# EasyEDA schematic SCH_Flight-Computer-V5_2024-08-07.json
TITLE: Flight Computer; REV: 1.0; Date: 2024-08-05; Sheet: 1/1; Drawn By: usedgenes; Company: Company
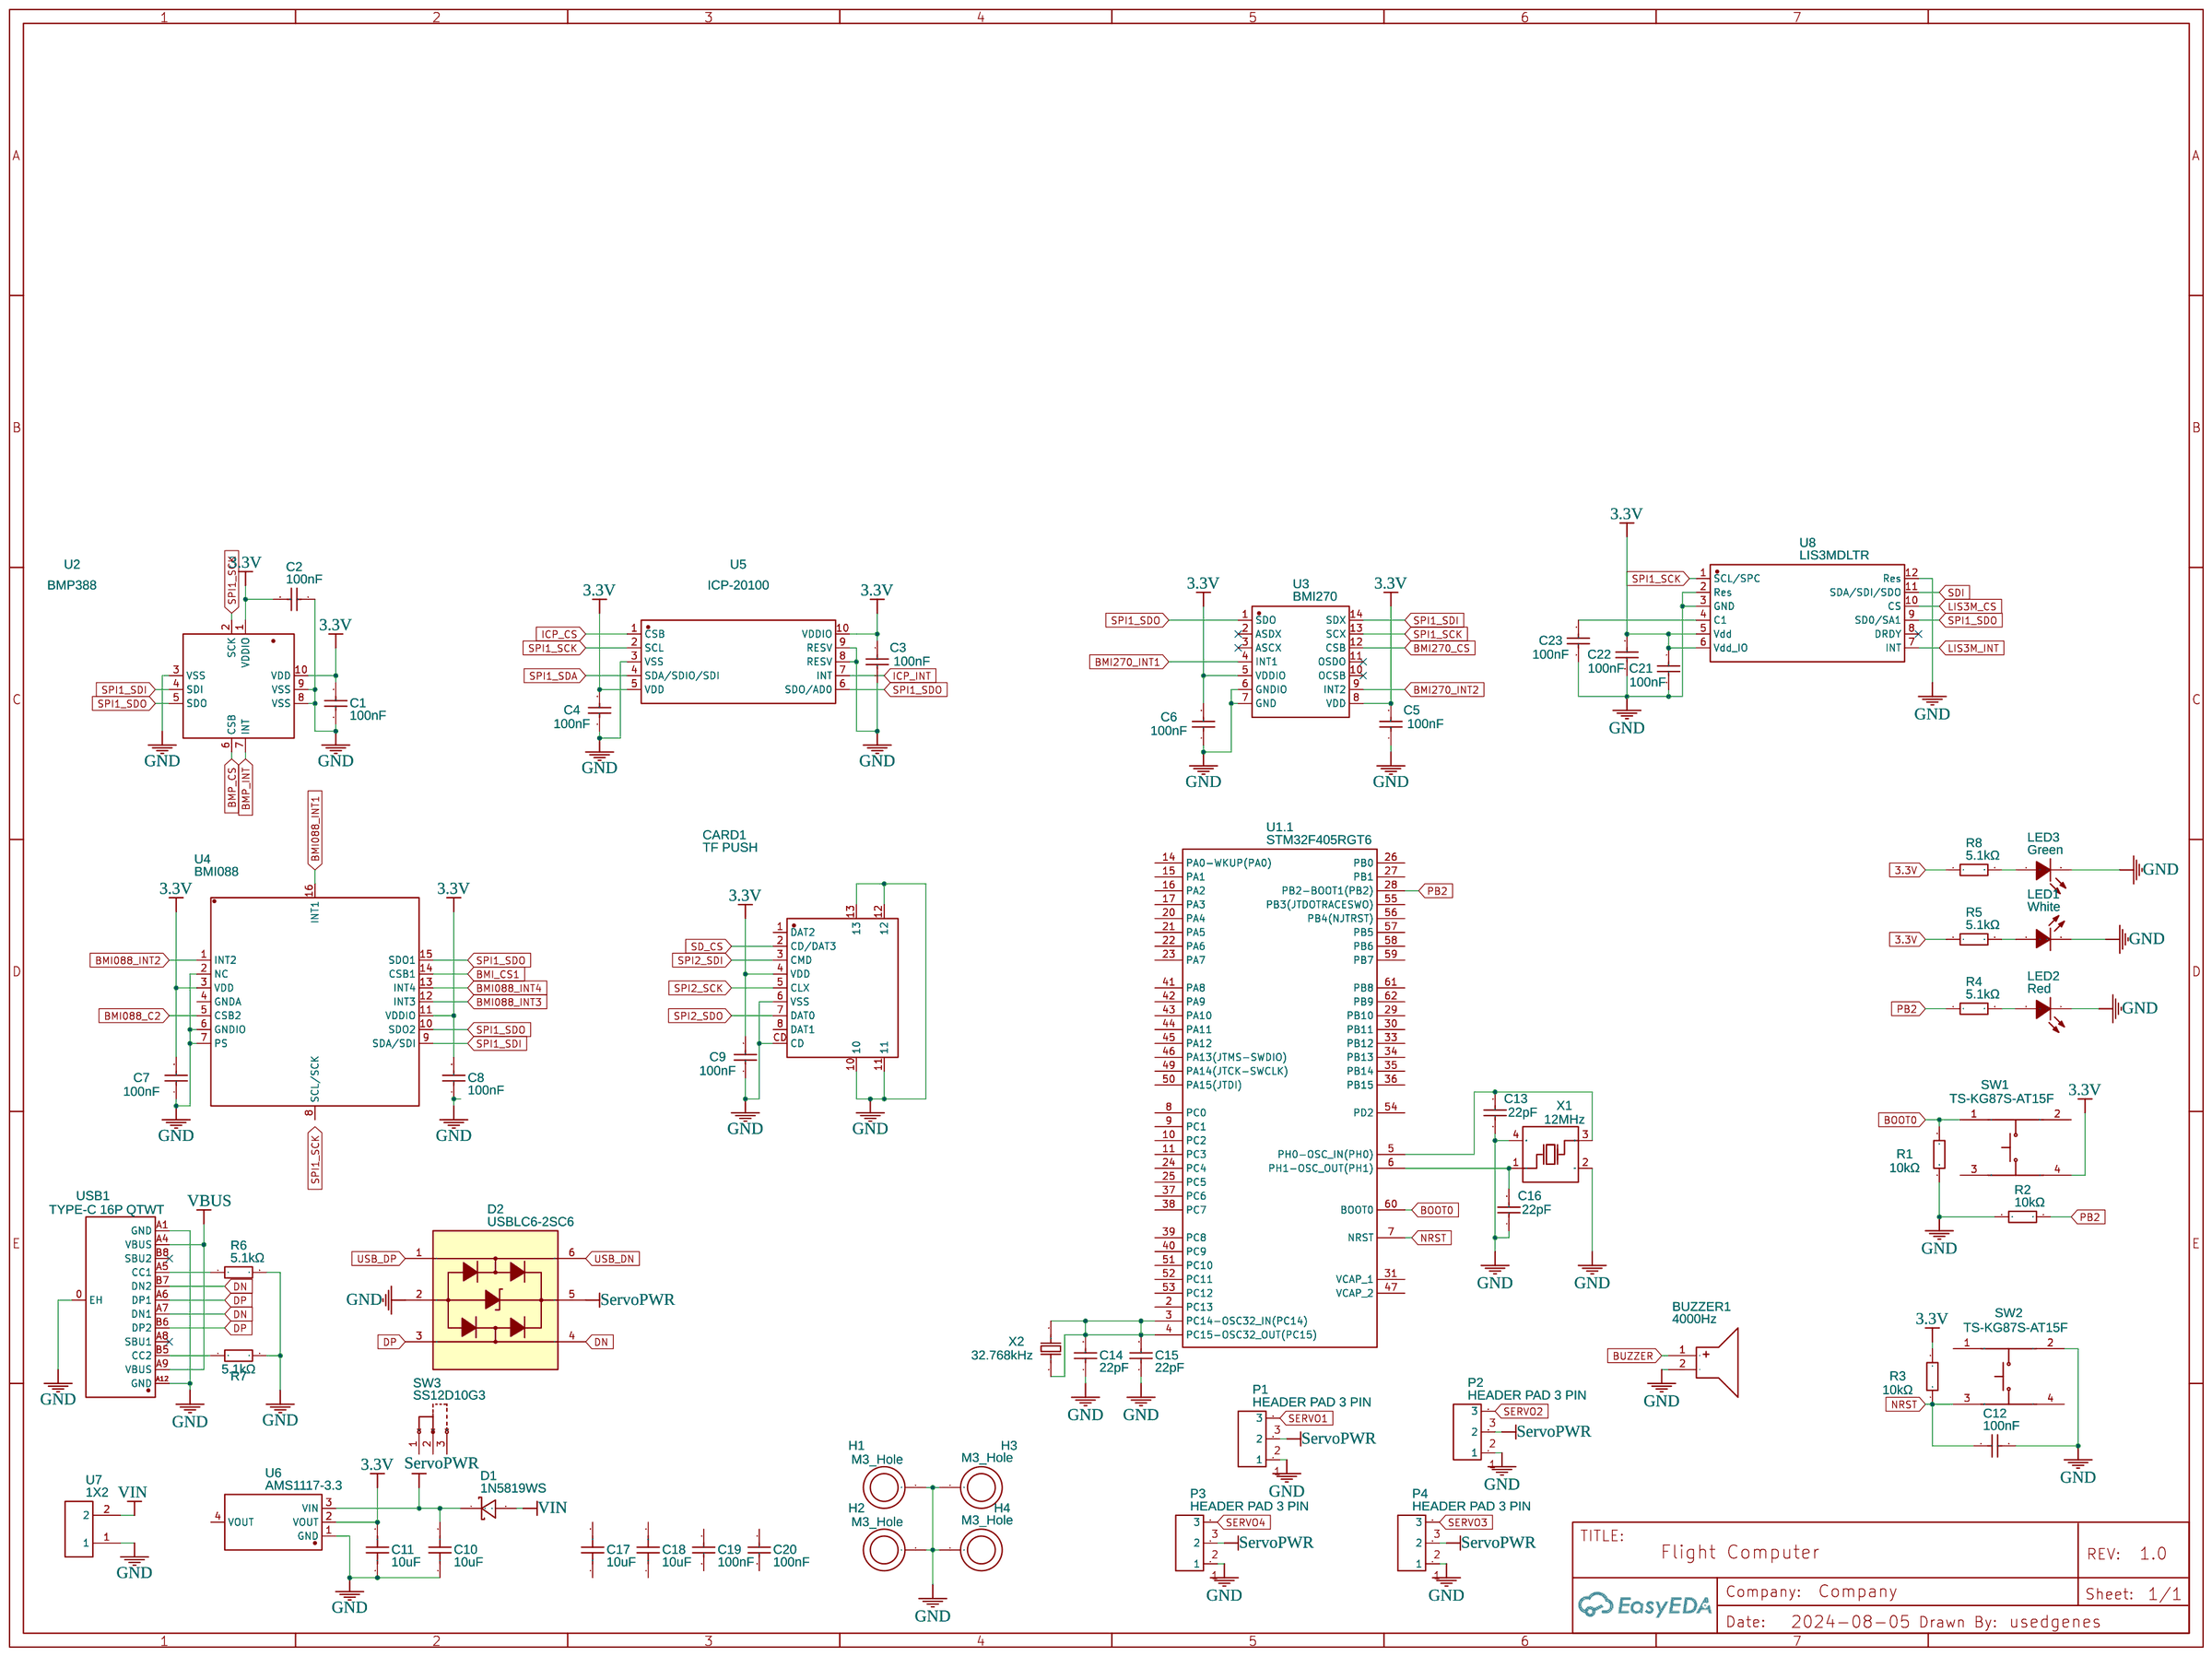
[diagram p0: schematic sheet]

## Parts
BUZZER1  4000Hz  [BUZ-TH_BD14.0-P7.60-D1.0-L]
C1  100nF  [C0402]
C2  100nF  [C0402]
C3  100nF  [C0402]
C4  100nF  [C0402]
C5  100nF  [C0402]
C6  100nF  [C0402]
C7  100nF  [C0402]
C8  100nF  [C0402]
C9  100nF  [C0402]
C10  10uF  [C0603]
C11  10uF  [C0603]
C12  100nF  [C0402]
C13  22pF  [C0402]
C14  22pF  [C0402]
C15  22pF  [C0402]
C16  22pF  [C0402]
C17  10uF  [C0603]
C18  10uF  [C0603]
C19  100nF  [C0402]
C20  100nF  [C0402]
C21  100nF  [C0402]
C22  100nF  [C0402]
C23  100nF  [C0402]
CARD1  TF PUSH  [TF-SMD_TF-PUSH]
D1  1N5819WS  [SOD-323_L1.8-W1.3-LS2.5-RD]
D2  USBLC6-2SC6  [SOT-23-6_L2.9-W1.6-P0.95-LS2.8-BL]
H1  M3_Hole  [HOLEHOLE]
H2  M3_Hole  [HOLEHOLE]
H3  M3_Hole  [HOLEHOLE]
H4  M3_Hole  [HOLEHOLE]
LED1  White  [LED0603-R-RD_WHITE]
LED2  Red  [LED0603-RD]
LED3  Green  [LED0805-R-RD]
P1  HEADER PAD 3 PIN  [CONNECTOR_PINHEADER_2.54MM:PINHEADER_1X3]
P2  HEADER PAD 3 PIN  [CONNECTOR_PINHEADER_2.54MM:PINHEADER_1X3]
P3  HEADER PAD 3 PIN  [CONNECTOR_PINHEADER_2.54MM:PINHEADER_1X3]
P4  HEADER PAD 3 PIN  [CONNECTOR_PINHEADER_2.54MM:PINHEADER_1X3]
R1  10kΩ  [R0603]
R2  10kΩ  [R0603]
R3  10kΩ  [R0603]
R4  5.1kΩ  [R0402]
R5  5.1kΩ  [R0402]
R6  5.1kΩ  [R0603]
R7  5.1kΩ  [R0603]
R8  5.1kΩ  [R0402]
SW1  TS-KG87S-AT15F  [SW-SMD_4P-L5.2-W5.2-P3.70-LS6.4]
SW2  TS-KG87S-AT15F  [SW-SMD_4P-L5.2-W5.2-P3.70-LS6.4]
SW3  SS12D10G3  [SW-TH_3P-P4.8-L12.7-W6.7_SS12D10G3]
U1  STM32F405RGT6  [LQFP-64_L10.0-W10.0-P0.50-LS12.0-BL]  (section 1)
U2  BMP388  [SENSORM-SMD_BMP388]
U3  BMI270  [LGA-14_L3.0-W2.5-P0.50-BR]
U4  BMI088  [LGA-16_L4.5-W3.0-P0.50-BL]
U5  ICP-20100  [LGA-10_L2.0-W2.0-P0.50-TL_ICP-20100]
U6  AMS1117-3.3  [SOT-223-3_L6.5-W3.4-P2.30-LS7.0-BR]
U7  1X2  [PIN HEADER CONNECTOR 1X2 PINS_PITCH 2.54MM]
U8  LIS3MDLTR  [LGA-12_L2.0-W2.0-P0.50-BL]
USB1  TYPE-C 16P QTWT  [USB-TYPE-C-SMD_TYPE-C-16P-QTWT]
X1  12MHz  [OSC-SMD_4P-L3.2-W2.5-BL]
X2  32.768kHz  [OSC-SMD_L3.2-W1.5]

## Library data of the parts
BUZZER1 = SKY-1475-0540-45P7.6: Contributor: LCSC; Supplier: LCSC; Supplier Part: C511707; Manufacturer: S&S(海旭); JLCPCB Part Class: Extended Part
C1-C9 C12 C19-C23 = CL05B104KO5NNNC: Supplier: LCSC; Manufacturer: SAMSUNG(三星); Supplier Part: C1525; JLCPCB Part Class: Basic Part
C10 C11 C17 C18 = CL10A106KP8NNNC: Supplier: LCSC; Manufacturer: SAMSUNG(三星); Supplier Part: C19702; JLCPCB Part Class: Basic Part
C13-C16 = 0402CG220J500NT: Supplier: LCSC; Manufacturer: FH(风华); Supplier Part: C1555; JLCPCB Part Class: Basic Part
CARD1 = TF PUSH: Contributor: LCSC; Supplier: LCSC; Supplier Part: C393941; Manufacturer: SHOU HAN(首韩); JLCPCB Part Class: Extended Part
D1 = 1N5819WS: Contributor: LCSC; Supplier: LCSC; Supplier Part: C191023; Manufacturer: Hottech(合科泰); JLCPCB Part Class: Basic Part
D2 = USBLC6-2SC6: Supplier: LCSC; Manufacturer: ST(意法半导体); Supplier Part: C7519; JLCPCB Part Class: Extended Part
H1-H4 = 3MM_HOLE_STICHING_VIAS_4MM_OUTER COPY: Contributor: Cillié Malan
LED1 = 0603White light_C2290: Supplier: LCSC; Manufacturer: KENTO; Manufacturer Part: KT-0603白灯; Supplier Part: C2290; JLCPCB Part Class: Basic Part
LED2 = KT-0603R: Supplier: LCSC; Manufacturer: KENTO; Supplier Part: C2286; JLCPCB Part Class: Basic Part
LED3 = 0805G (Green): Supplier: LCSC; Manufacturer: KENTO; Manufacturer Part: KT-0805G; Supplier Part: C2297; JLCPCB Part Class: Basic Part
P1-P4 = HEADER PAD 3 PIN: Supplier: LCSC; Manufacturer: BOOMELE; Manufacturer Part: Female headerHDR1X8-2.54; Supplier Part: C27438; JLCPCB Part Class: Extended Part; Contributor: juchani
R1-R3 = 0603WAF1002T5E: Supplier: LCSC; Manufacturer: UNI-ROYAL(厚声); Supplier Part: C25804; JLCPCB Part Class: Basic Part
R4 R5 R8 = 0402WGF5101TCE: Supplier: LCSC; Manufacturer: UNI-ROYAL(厚声); Supplier Part: C25905; JLCPCB Part Class: Basic Part
R6 R7 = 0603WAF5101T5E: Supplier: LCSC; Manufacturer: UNI-ROYAL(厚声); Supplier Part: C23186; JLCPCB Part Class: Basic Part
SW1 SW2 = TS-KG87S-AT15F: Contributor: LCSC; Supplier: LCSC; Supplier Part: C2874421; Manufacturer: HANBO(汉博); JLCPCB Part Class: Extended Part
SW3 = SS12D10G3: Supplier: LCSC; Supplier Part: C7431053; Manufacturer: SHOU HAN(首韩); Contributor: lcsc
U1 = STM32F405RGT6: tags: STM32; subpart_no: 1; image: http://image.lceda.cn/szlcsc/C15742.jpg; Supplier Part: C15742; Supplier: LCSC; Manufacturer: ST(意法半导体); JLCPCB Part Class: Extended Part
U2 = BMP388: Contributor: LCSC; Supplier: LCSC; Supplier Part: C779278; Manufacturer: Bosch(博世); JLCPCB Part Class: Extended Part
U3 = BMI270: Contributor: LCSC; Supplier: LCSC; Supplier Part: C2836813; Manufacturer: Bosch(博世); JLCPCB Part Class: Extended Part
U4 = BMI088: Contributor: LCSC; Supplier: LCSC; Supplier Part: C194919; Manufacturer: Bosch(博世); JLCPCB Part Class: Extended Part
U5 = ICP-20100: Supplier: LCSC; Supplier Part: C5343527; Manufacturer: TDK; JLCPCB Part Class: Extended Part; Contributor: lcsc
U6 = AMS1117-3.3: sourceId: dwIGgezVh; Supplier: LCSC; Manufacturer: AMS; Supplier Part: C6186; JLCPCB Part Class: Basic Part
U7 = 1X2: Contributor: suriya.chun
U8 = LIS3MDLTR: Contributor: LCSC; Supplier: LCSC; Supplier Part: C478483; Manufacturer: ST(意法半导体); JLCPCB Part Class: Extended Part
USB1 = TYPE-C 16P QTWT: Contributor: lcsc; Supplier: LCSC; Supplier Part: C5187472; Manufacturer: SHOU HAN(首韩); JLCPCB Part Class: Extended Part
X1 = X322512MSB4SI: Supplier: LCSC; Manufacturer: YXC(扬兴晶振); Supplier Part: C9002; JLCPCB Part Class: Basic Part
X2 = SC-32S32.768kHz20PPM12.5pF: Supplier: LCSC; Manufacturer: Seiko(精工); Supplier Part: C97606; JLCPCB Part Class: Extended Part

## Nets
3.3V: C1.2 C2.2 C3.2 C4.2 C5.2 C6.2 C7.2 C8.2 C9.2 C11.2 C21.1 C22.1 CARD1.4(VDD) R3.2 R5.1 R8.1 SW1.4 U2.1(VDDIO) U2.10(VDD) U3.5(VDDIO) U3.8(VDD) U4.3(VDD) U4.11(VDDIO) U5.5(VDD) U5.10(VDDIO) U6.2(VOUT) U8.5(Vdd) U8.6(Vdd_IO)
GND: BUZZER1.2(-) C1.1 C2.1 C3.1 C4.1 C5.1 C6.1 C7.1 C8.1 C9.1 C10.1 C11.1 C12.2 C13.1 C14.1 C15.1 C16.1 C21.2 C22.2 C23.2 CARD1.6(VSS) CARD1.10 CARD1.11 CARD1.12 CARD1.13 CARD1.CD D2.2 H1.1 H2.1 H3.1 H4.1 LED1.2(K) LED2.1(K) LED3.2(K) P1.1 P2.1 P3.1 P4.1 R1.1 R2.2 R6.2 R7.2 SW2.2 U2.3(VSS) U2.8(VSS) U2.9(VSS) U3.6(GNDIO) U3.7(GND) U4.2(NC) U4.6(GNDIO) U4.7(PS) U5.3(VSS) U5.8(RESV) U5.9(RESV) U6.1(GND) U7.1 U8.2(Res) U8.3(GND) U8.12(Res) USB1.0(EH) USB1.A1(GND) USB1.A12(GND) X1.2(GND) X1.4(GND)
VBUS: USB1.A4(VBUS) USB1.A9(VBUS)
VIN: D1.2(A) U7.2
BMI088_C2: U4.5(CSB2)
BMI088_INT1: U4.16(INT1)
BMI088_INT2: U4.1(INT2)
BMI088_INT3: U4.12(INT3)
BMI088_INT4: U4.13(INT4)
BMI270_CS: U3.12(CSB)
BMI270_INT1: U3.4(INT1)
BMI270_INT2: U3.9(INT2)
BMI_CS1: U4.14(CSB1)
BMP_CS: U2.6(CSB)
BMP_INT: U2.7(INT)
BOOT0: R1.2 SW1.1 U1.60(BOOT0)
BUZZER: BUZZER1.1(+)
DN: D2.4 USB1.A7(DN1) USB1.B7(DN2)
DP: D2.3 USB1.A6(DP1) USB1.B6(DP2)
ICP_CS: U5.1(CSB)
ICP_INT: U5.7(INT)
LIS3M_CS: U8.10(CS)
LIS3M_INT: U8.7(INT)
NRST: C12.1 R3.1 SW2.3 U1.7(NRST)
PB2: R2.1 R4.1 U1.28(PB2-BOOT1(PB2))
SD_CS: CARD1.2(CD/DAT3)
SDI: U8.11(SDA/SDI/SDO)
SERVO1: P1.3
SERVO2: P2.3
SERVO3: P4.3
SERVO4: P3.3
ServoPWR: C10.2 D1.1(K) D2.5 P1.2 P2.2 P3.2 P4.2 U6.3(VIN)
SPI1_SCK: U2.2(SCK) U3.13(SCX) U5.2(SCL) U8.1(SCL/SPC)
SPI1_SDA: U5.4(SDA/SDIO/SDI)
SPI1_SDI: U2.4(SDI) U3.14(SDX) U4.9(SDA/SDI)
SPI1_SDO: U2.5(SDO) U3.1(SDO) U4.10(SDO2) U4.15(SDO1) U5.6(SDO/AD0) U8.9(SD0/SA1)
SPI2_SCK: CARD1.5(CLX)
SPI2_SDI: CARD1.3(CMD)
SPI2_SDO: CARD1.7(DAT0)
USB_DN: D2.6
USB_DP: D2.1
Net-(C13-2): C13.2 U1.5(PH0-OSC_IN(PH0)) X1.3(OSC2)
Net-(C14-2): C14.2 C15.2 U1.3(PC14-OSC32_IN(PC14)) U1.4(PC15-OSC32_OUT(PC15)) X2.1 X2.2
Net-(C16-2): C16.2 U1.6(PH1-OSC_OUT(PH1)) X1.1(OSC1)
Net-(C23-1): C23.1 U8.4(C1)
Net-(LED1-1): LED1.1(A) R5.2
Net-(LED2-2): LED2.2(A) R4.2
Net-(LED3-1): LED3.1(A) R8.2
Net-(R6-1): R6.1 USB1.A5(CC1)
Net-(R7-1): R7.1 USB1.B5(CC2)

Not connected (* = marked no-connect by the designer): C17 1 2; C18 1 2; C19 1 2; C20 1 2; CARD1 1(DAT2) 8(DAT1); SW1 2 3; SW2 1 4; SW3 1 2 3; U1 2(PC13) 8(PC0) 9(PC1) 10(PC2) 11(PC3) 14(PA0-WKUP(PA0)) 15(PA1) 16(PA2) 17(PA3) 20(PA4) 21(PA5) 22(PA6) 23(PA7) 24(PC4) 25(PC5) 26(PB0) 27(PB1) 29(PB10) 30(PB11) 31(VCAP_1) 33(PB12) 34(PB13) 35(PB14) 36(PB15) 37(PC6) 38(PC7) 39(PC8) 40(PC9) 41(PA8) 42(PA9) 43(PA10) 44(PA11) 45(PA12) 46(PA13(JTMS-SWDIO)) 47(VCAP_2) 49(PA14(JTCK-SWCLK)) 50(PA15(JTDI)) 51(PC10) 52(PC11) 53(PC12) 54(PD2) 55(PB3(JTDOTRACESWO)) 56(PB4(NJTRST)) 57(PB5) 58(PB6) 59(PB7) 61(PB8) 62(PB9); U3 2(ASDX)* 3(ASCX)* 10(OCSB)* 11(OSDO)*; U4 4(GNDA) 8(SCL/SCK); U6 4(VOUT); U8 8(DRDY)*; USB1 A8(SBU1)* B8(SBU2)*
